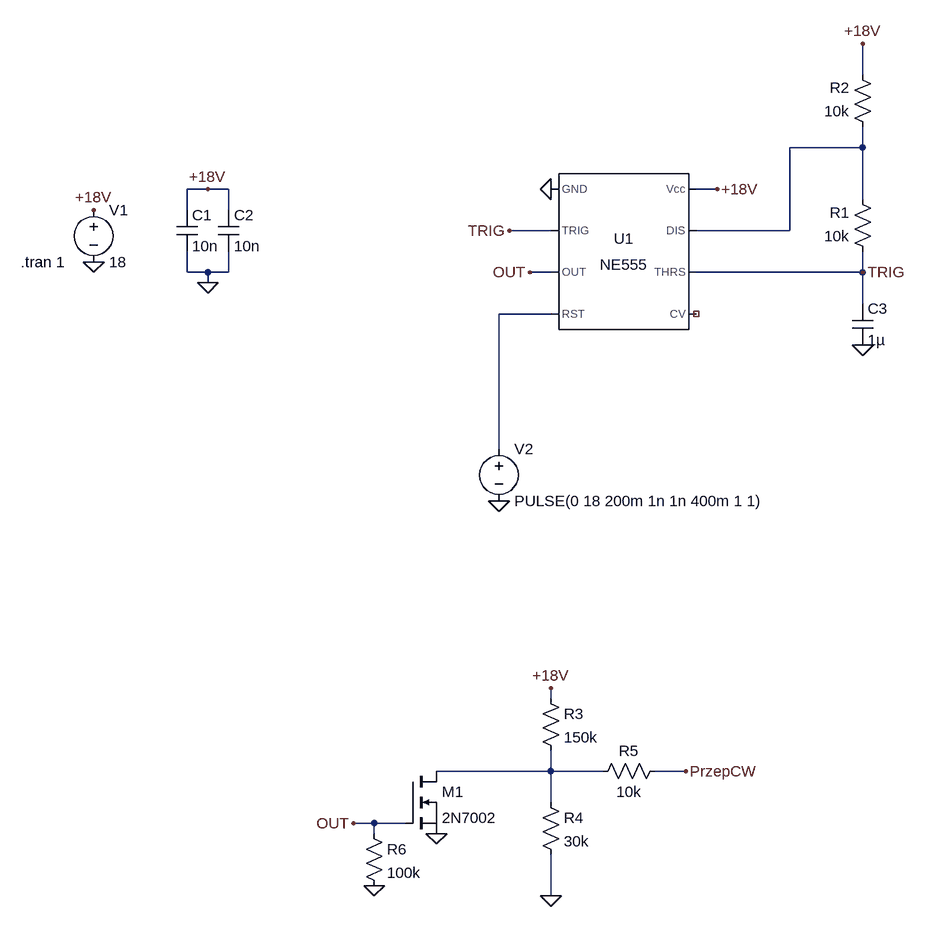
[diagram p0: schematic Simulation.asc]
Simulation.asc, the LTspice schematic file:
Version 4.1
SHEET 1 880 1188
WIRE 576 -96 576 -144
WIRE 576 16 576 -16
WIRE 576 16 464 16
WIRE -432 80 -464 80
WIRE -400 80 -432 80
WIRE 352 80 320 80
WIRE 576 96 576 16
WIRE -464 112 -464 80
WIRE -400 112 -400 80
WIRE 96 144 32 144
WIRE 464 144 464 16
WIRE 464 144 320 144
WIRE -464 208 -464 176
WIRE -432 208 -464 208
WIRE -400 208 -400 176
WIRE -400 208 -432 208
WIRE 96 208 64 208
WIRE 576 208 576 176
WIRE 576 208 320 208
WIRE -432 224 -432 208
WIRE 576 256 576 208
WIRE 96 272 16 272
WIRE 16 480 16 272
WIRE 96 864 96 848
WIRE 96 976 96 944
WIRE 96 976 -80 976
WIRE 176 976 96 976
WIRE 304 976 256 976
WIRE 96 1024 96 976
WIRE -176 1056 -208 1056
WIRE -128 1056 -176 1056
WIRE -176 1072 -176 1056
WIRE 96 1168 96 1104
FLAG -608 192 0
FLAG 96 80 0
FLAG -608 112 +18V
FLAG 352 80 +18V
FLAG -432 224 0
FLAG -432 80 +18V
FLAG 576 -144 +18V
FLAG 32 144 TRIG
FLAG 576 208 TRIG
FLAG 576 320 0
FLAG 64 208 OUT
FLAG 16 560 0
FLAG 96 1168 0
FLAG 96 848 +18V
FLAG 304 976 PrzepCW
FLAG -208 1056 OUT
FLAG -80 1072 0
FLAG -176 1152 0
SYMBOL Misc\\NE555 208 176 R0
SYMATTR InstName U1
SYMBOL voltage -608 96 R0
WINDOW 123 0 0 Left 0
WINDOW 39 0 0 Left 0
SYMATTR InstName V1
SYMATTR Value 18
SYMBOL cap -480 112 R0
SYMATTR InstName C1
SYMATTR Value 10n
SYMBOL cap -416 112 R0
SYMATTR InstName C2
SYMATTR Value 10n
SYMBOL res 592 192 R180
WINDOW 0 36 76 Left 2
WINDOW 3 36 40 Left 2
SYMATTR InstName R1
SYMATTR Value 10k
SYMBOL res 592 0 R180
WINDOW 0 36 76 Left 2
WINDOW 3 36 40 Left 2
SYMATTR InstName R2
SYMATTR Value 10k
SYMBOL cap 560 256 R0
SYMATTR InstName C3
SYMATTR Value 1µ
SYMBOL voltage 16 464 R0
WINDOW 123 0 0 Left 0
WINDOW 39 0 0 Left 0
SYMATTR InstName V2
SYMATTR Value PULSE(0 18 200m 1n 1n 400m 1 1)
SYMBOL res 80 848 R0
SYMATTR InstName R3
SYMATTR Value 150k
SYMBOL res 80 1008 R0
SYMATTR InstName R4
SYMATTR Value 30k
SYMBOL res 272 960 R90
WINDOW 0 0 56 VBottom 2
WINDOW 3 32 56 VTop 2
SYMATTR InstName R5
SYMATTR Value 10k
SYMBOL nmos -128 976 R0
SYMATTR InstName M1
SYMATTR Value 2N7002
SYMBOL res -192 1056 R0
SYMATTR InstName R6
SYMATTR Value 100k
TEXT -720 192 Left 2 !.tran 1

The netlist it stands for:
* Simulation.asc
X§U1 0 TRIG OUT N002 NC_01 TRIG N001 +18V NE555  ; pins GND TRIG OUT RST CV THRS DIS Vcc
V1 +18V 0 18
C1 +18V 0 10n
C2 +18V 0 10n
R1 TRIG N001 10k
R2 N001 +18V 10k
C3 TRIG 0 1µ
V2 N002 0 PULSE(0 18 200m 1n 1n 400m 1 1)
R3 +18V N003 150k
R4 N003 0 30k
R5 PrzepCW N003 10k
M1 N003 OUT 0 0 2N7002
R6 OUT 0 100k
.model NMOS NMOS
.model PMOS PMOS
.lib standard.mos
.tran 1
.lib NE555.sub
.backanno
.end